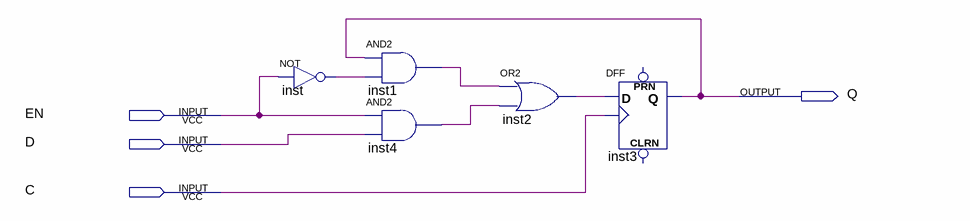
[diagram p0: schematic sheet]
// Quartus schematic load.bdf as structural Verilog: 5 symbols, 4 pins
module load (
  input  EN,
  input  D,
  input  C,
  output Q
);

  wire inst1_out, inst2_out, inst4_out, inst_out;

  not inst (inst_out, EN);
  and inst1 (inst1_out, Q, inst_out);
  and inst4 (inst4_out, EN, D);
  or inst2 (inst2_out, inst1_out, inst4_out);
  DFF inst3 (.CLK(C), .D(inst2_out), .Q(Q));  // open: CLRN, PRN
endmodule
